# EAGLE design ventmon_t0.5c (EAGLE 9.6.2)

## Sheet 1 of 2
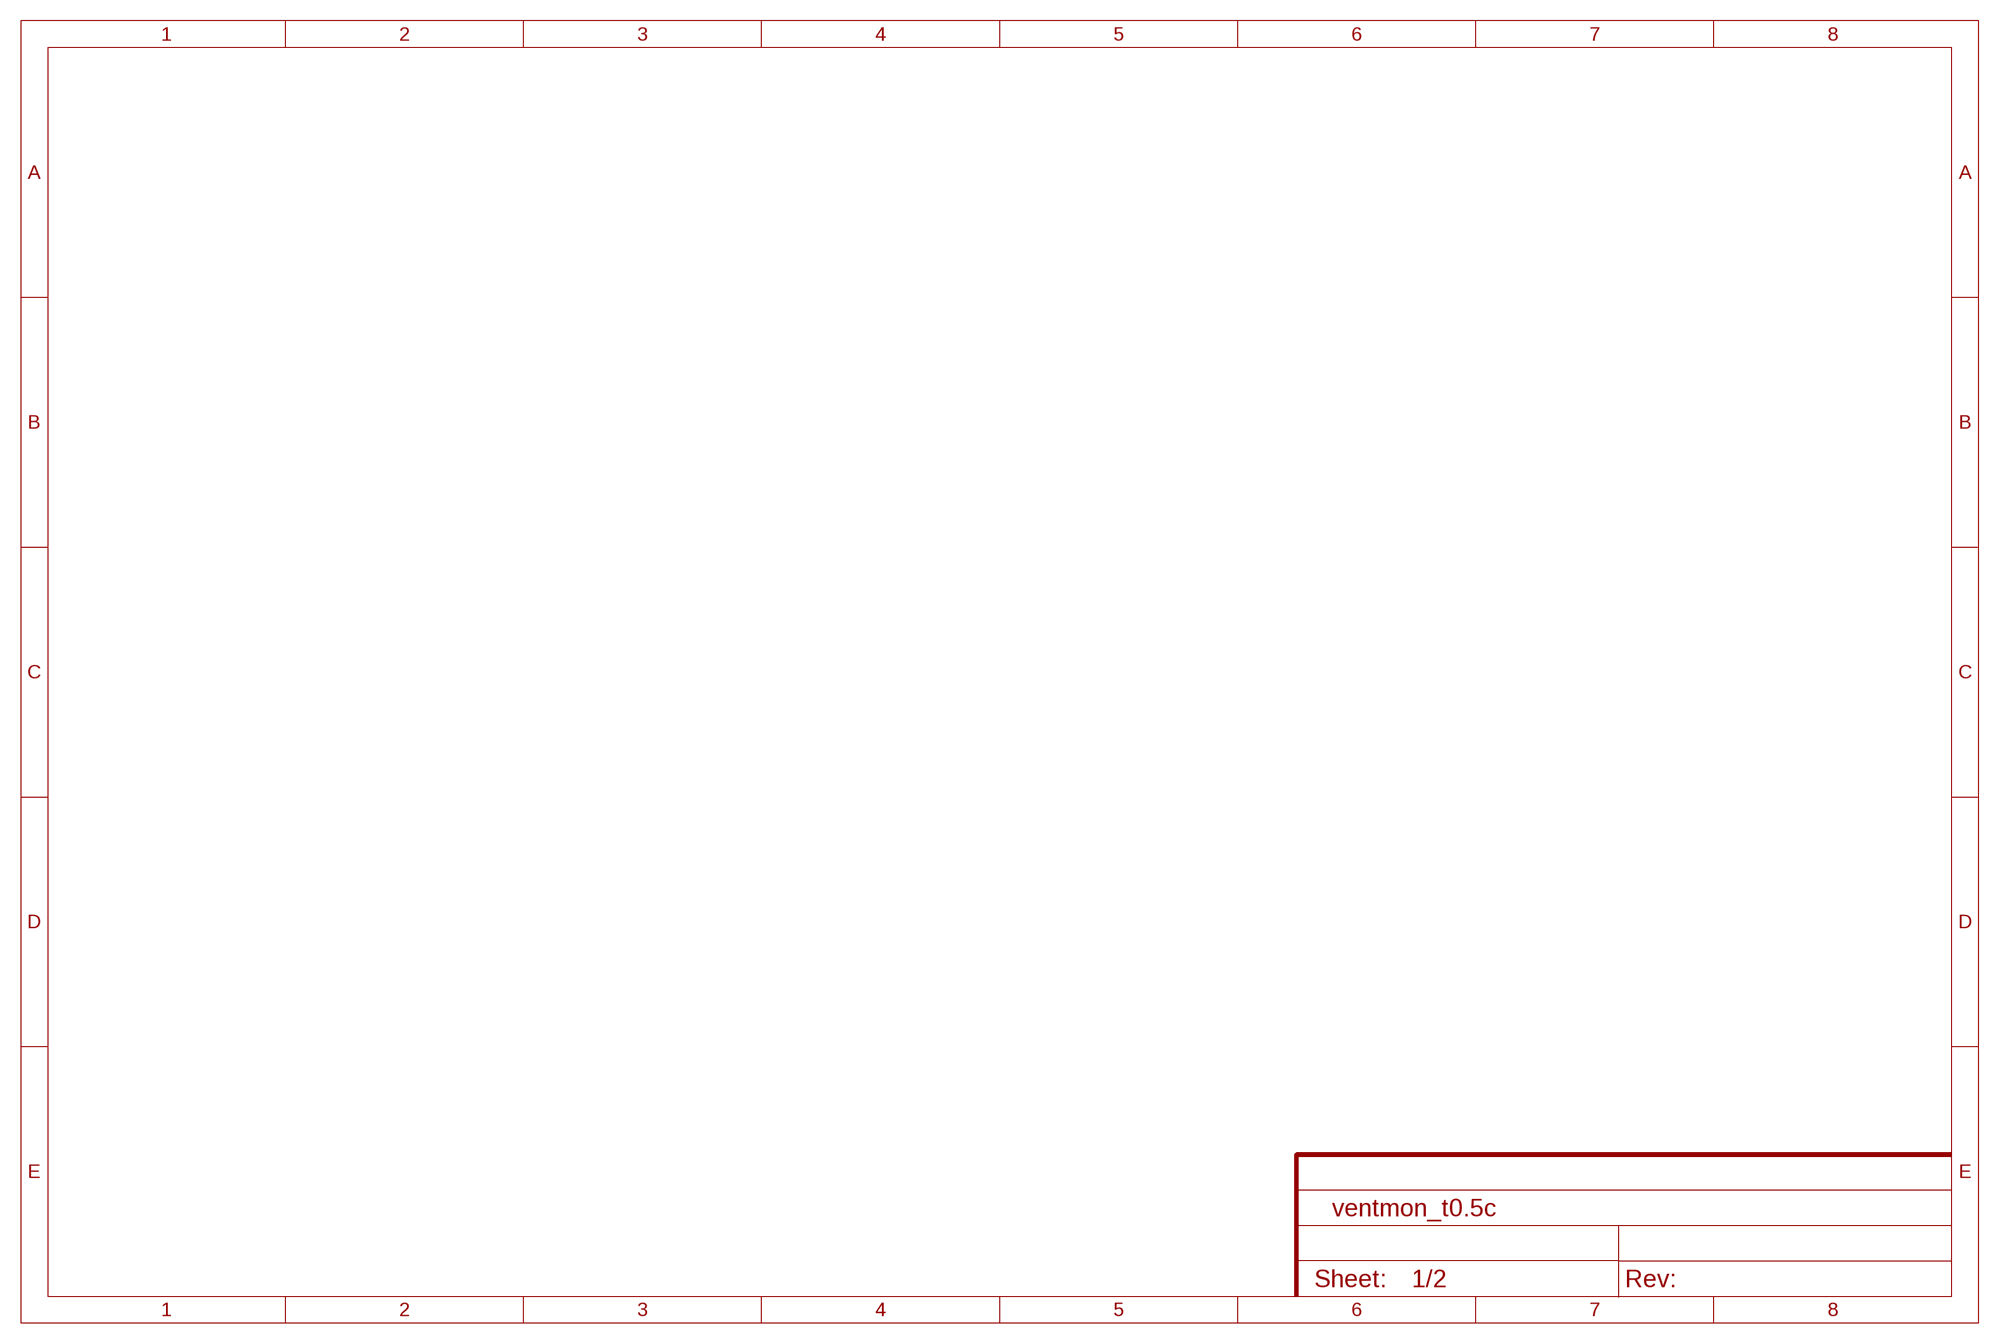
[diagram p0: schematic, sheet 1]

## Sheet 2 of 2
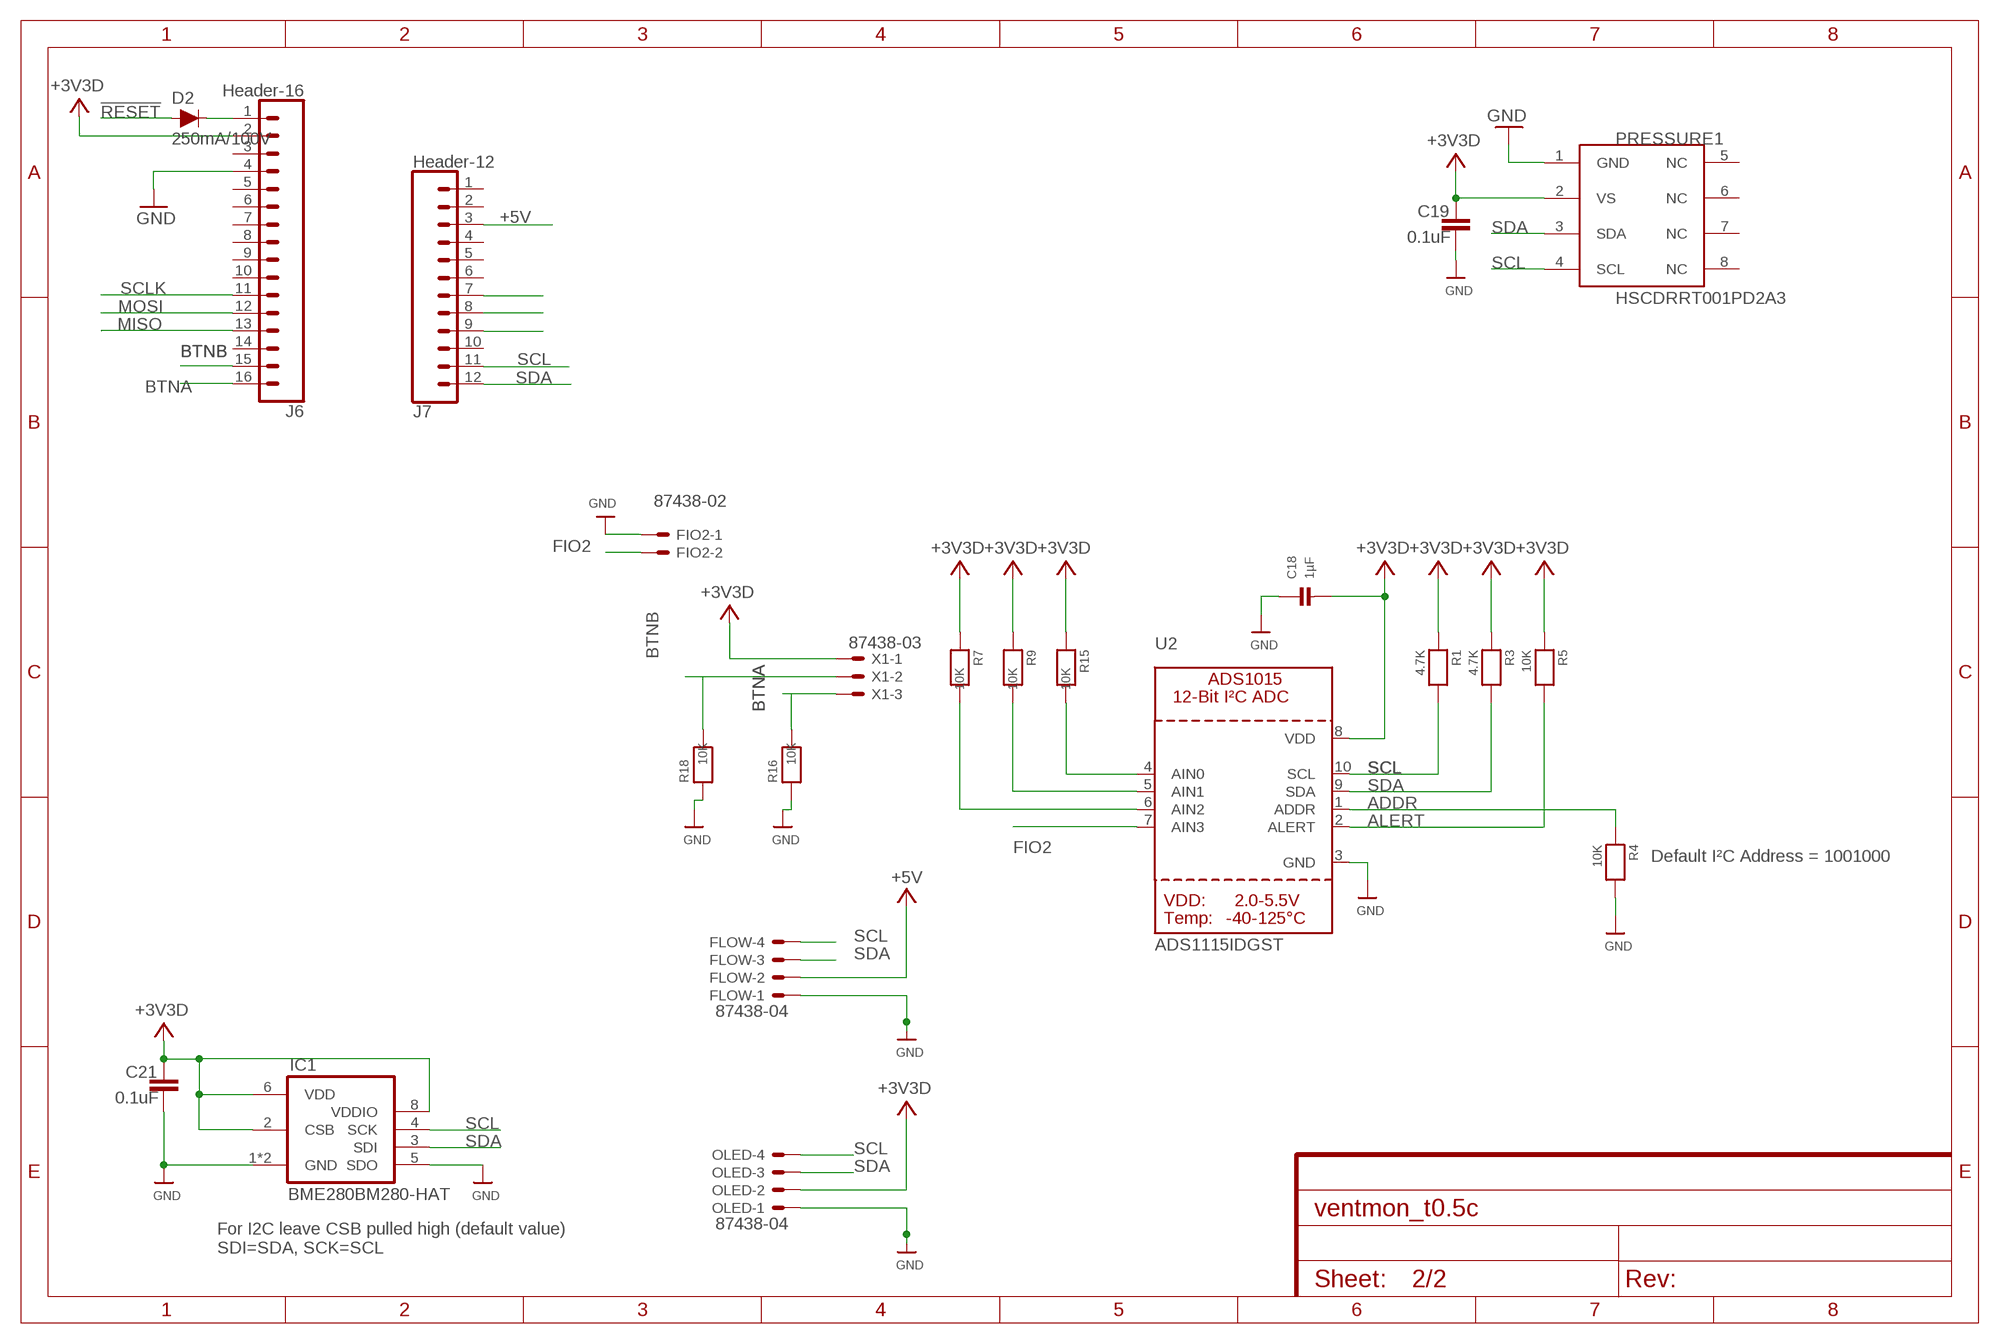
[diagram p1: schematic, sheet 2]

### Parts
C18  1µF  CAP_CERAMIC0603  [0603]
C19  0.1uF  CAP_1  [C0402_B]
C21  0.1uF  CAP_1  [C0402_B]
D2  250mA/100V  DIODE-BAS16J  [SOD-323]
FIO2  87438-02  [87438-02]
FLOW  87438-04  [87438-04]
IC1  BME280BM280-HAT  [BME280-HAT]
J6  Header-16  CONN_16  [1X16]
J7  Header-12  CONN_12  [1X12]
OLED  87438-04  [87438-04]
PRESSURE1  HSCDRRT001PD2A3  [DIP1330W46P254L1000H616Q8B]
R1  4.7K  RESISTOR0603  [0603]
R3  4.7K  RESISTOR0603  [0603]
R4  10K  RESISTOR0603  [0603]
R5  10K  RESISTOR0603  [0603]
R7  10K  RESISTOR0603  [0603]
R9  10K  RESISTOR0603  [0603]
R15  10K  RESISTOR0603  [0603]
R16  10K  RESISTOR0603  [0603]
R18  10K  RESISTOR0603  [0603]
U2  ADS1115IDGST  ADC_ADS1015  [MSOP10]
X1  87438-03  [87438-03]

### Nets
!RESET: D2.A
+3V3: C18.2 C19.2 C21.2 IC1.2(CSB) IC1.6(VDD) IC1.8(VDDIO) J6.2 OLED.2 PRESSURE1.2(VS) R1.1 R3.1 R5.1 R7.1 R9.1 R15.1 U2.8(VDD) X1.1 ; supply symbol labelled +3V3D
+5V: FLOW.2 J7.3
ADDR: R4.1 U2.1(ADDR)
ALERT: R5.2 U2.2(ALERT)
BTNA: J6.16 R16.2 X1.3
BTNB: J6.15 R18.2 X1.2
FIO2: FIO2.2 U2.7(AIN3)
GND: C18.1 C19.1 C21.1 FIO2.1 FLOW.1 IC1.1(GND) IC1.5(SDO) IC1.7(GND) J6.4 OLED.1 PRESSURE1.1(GND) R4.2 R16.1 R18.1 U2.3(GND)
MISO: J6.13
MOSI: J6.12
N$4: D2.C J6.1
N$24: J7.7
N$25: J7.8
N$26: J7.9
N$38: R7.2 U2.6(AIN2)
N$40: R9.2 U2.5(AIN1)
N$45: R15.2 U2.4(AIN0)
SCL: FLOW.4 IC1.4(SCK) J7.11 OLED.4 PRESSURE1.4(SCL) R1.2 U2.10(SCL)
SCLK: J6.11
SDA: FLOW.3 IC1.3(SDI) J7.12 OLED.3 PRESSURE1.3(SDA) R3.2 U2.9(SDA)
Unconnected: J6.3 J6.5 J6.6 J6.7 J6.8 J6.9 J6.10 J6.14 J7.1 J7.2 J7.4 J7.5 J7.6 J7.10 PRESSURE1.5(NC) PRESSURE1.6(NC) PRESSURE1.7(NC) PRESSURE1.8(NC)

### Notes on the sheet
- Default I²C Address = 1001000
- For I2C leave CSB pulled high (default value)
  SDI=SDA, SCK=SCL

## Library data of the parts
C18 = microbuilder:CAP_CERAMIC: Ceramic Capacitors 0402 - 0402 Surface Mount Capacitors 16pF 50V 5% [Digikey: 445-4899-2-ND] 18pF 50V 5% [Digikey: 490-1281-2-ND] 22pF 50V 5% [Digikey: 490-1283-2-ND] 68pF 50V 5% [Digikey: 490-1289-2-ND] 0.1uF 10V 10% [Digikey: 490-1318-2-ND] 1.0uF 6.3V 10% [Digikey: 490-1320-2-ND] 0603 - 0603 Surface Mount Capacitors 16 pF 50V 5% [Digikey: 445-5051-2-ND] 22 pF 50V [Digikey: PCC220ACVTR-ND] 33 pF 50V 5% [Digikey: 490-1415-1-ND] 56pF 50V 5% [Digikey: 490-1421-1-ND] 220pF 50V 5% [Digikey: 445-1285-1-ND] 680 pF 50V 2200 pF 50V 5% C0G [Digikey: 445-1297-1-ND] 5600 pF 100V 5% X7R [Digikey: 478-3711-1-ND] 0.1 µF 25V 10% [Digikey: PCC2277TR-ND] 0.22 µF 16V 10% X7R [Digikey: 445-1318-1-ND] 1.0 µF 25V 10% [Digikey: 445-5146-2-ND] 0603 - RF Specific 3pF 250V +/-0.1pF RF [Digikey: 712-1347-1-ND] 18 pF 250V 5% [Digikey: 478-3505-1-ND or 712-1322-1-ND] 56 pF 250V 5% C0G RF [Digikey: 490-4867-1-ND] 68 pF 250V RF [Digikey: 490-4868-1-ND] 0805 - 0805 Surface Mount Capacitors 220 pF 250V 2% RF Ceramic Capacitor [Digikey: 712-1398-1-ND] 1000 pF 50V 2% NP0 Ceramic Capacitor [Digikey: 478-3760-1-ND] 0.1 µF 25V 10% Ceramic Capacitor [Digikey: PCC1828TR-ND] 1.0 µF 16V 10% Ceramic Capacitor[Digikey: 490-1691-2-ND] 10.0 µF 10V 10% Ceramic Capacitor[Digikey: 709-1228-1-ND] 10.0 uF 16V 10% Ceramic Capacitor [Digikey: 478-5165-2-ND] 47 uF 6.3V 20% Ceramic Capacitor [Digikey: 587-1779-1-ND or 399-5506-1-ND] 1206 - 1206 Surface Mount Capacitors 47uF 10V 20% Ceramic Capacitor [Digikey: 490-5528-1-ND or 399-5508-1-ND or 445-6010-1-ND] 100uF 6.3V -20%, +80% Y5V Ceramic Capacitor (Digikey: 490-4512-1-ND, Mouser: 81-GRM31CF50J107ZE1L)
C19 C21 = Particle:CAP_1
D2 = SparkFun-DiscreteSemi:DIODE: Diode These are standard reverse protection diodes and small signal diodes. SparkFun Products: SparkFun SparkPunk Sound Kit <https://www.sparkfun.com/products/11177> SparkFun ESP8266 Thing <https://www.sparkfun.com/products/13231>; PROD_ID: DIO-09646
FIO2 = con-molex:87438-02: Wire-to-Board 1.50mm (.059") Pitch Header - Right Angle, SMT, Shrouded Source: http://www.molex.com/product/micro/87438.html; MF: MOLEX; OC_FARNELL: 1711327; OC_NEWARK: unknown
FLOW OLED = con-molex:87438-04: Wire-to-Board 1.50mm (.059") Pitch Header - Right Angle, SMT, Shrouded Source: http://www.molex.com/product/micro/87438.html; MF: MOLEX; OC_FARNELL: unknown; OC_NEWARK: unknown
IC1 = bosch-bme280:BME280: DIGITAL HUMIDITY, PRESSURE AND TEMPERATURE SENSOR * Digital interface I²C (up to 3.4 MHz) and SPI (3 and 4 wire, up to 10 MHz)* Supply voltage VDD main supply voltage range: 1.71 V to 3.6 V*VDDIO interface voltage range: 1.2 V to 3.6 V Operating range -40…+85 °C, 0…100 % rel. humidity, 300…1100 hPa The library has been designed by Richard Magdycz <https://www.facebook.com/groups/eaglecadsoftUK>
J6 = SparkFun-Connectors:CONN_16: Multi connection point. Often used as Generic Header-pin footprint for 0.1 inch spaced/style header connections On any of the 0.1 inch spaced packages, you can populate with these: Break Away Headers - Straight <https://www.sparkfun.com/products/116> (PRT-00116) Break Away Male Headers - Right Angle <https://www.sparkfun.com/products/553> (PRT-00553) Female Headers <https://www.sparkfun.com/products/115> (PRT-00115) Break Away Headers - Machine Pin <https://www.sparkfun.com/products/117> (PRT-00117) Break Away Female Headers - Swiss Machine Pin <https://www.sparkfun.com/products/743> (PRT-00743) For SCREWTERMINALS and SPRING TERMINALS visit here: Screw Terimnals on SparkFun.com <https://www.sparkfun.com/search/results?term=Screw+Terminals> (5mm/3.5mm/2.54mm spacing) This device is also useful as a general connection point to wire up your design to another part of your project. Our various solder wires solder well into these plated through hole pads. Hook-Up Wire - Assortment (Stranded, 22 AWG) <https://www.sparkfun.com/products/11375> (PRT-11375) Hook-Up Wire - Assortment (Solid Core, 22 AWG) <https://www.sparkfun.com/products/11367> (PRT-11367) View the entire wire category on our website here <https://www.sparkfun.com/categories/141> Special notes: Molex polarized connector foot print use with SKU : PRT-08231 with associated crimp pins and housings. 1MM SMD Version SKU: PRT-10208 NOTES ON THE VARIANTS LOCK and LOCK_LONGPADS... This footprint was designed to help hold the alignment of a through-hole component (i.e. 6-pin header) while soldering it into place. You may notice that each hole has been shifted either up or down by 0.005 of an inch from it's more standard position (which is a perfectly straight line). This slight alteration caused the pins (the squares in the middle) to touch the edges of the holes. Because they are alternating, it causes a "brace" to hold the component in place. 0.005 has proven to be the perfect amount of "off-center" position when using our standard breakaway headers. Although looks a little odd when you look at the bare footprint, once you have a header in there, the alteration is very hard to notice. Also,if you push a header all the way into place, it is covered up entirely on the bottom side.
J7 = SparkFun-Connectors:CONN_12: Multi connection point. Often used as Generic Header-pin footprint for 0.1 inch spaced/style header connections On any of the 0.1 inch spaced packages, you can populate with these: Break Away Headers - Straight <https://www.sparkfun.com/products/116> (PRT-00116) Break Away Male Headers - Right Angle <https://www.sparkfun.com/products/553> (PRT-00553) Female Headers <https://www.sparkfun.com/products/115> (PRT-00115) Break Away Headers - Machine Pin <https://www.sparkfun.com/products/117> (PRT-00117) Break Away Female Headers - Swiss Machine Pin <https://www.sparkfun.com/products/743> (PRT-00743) For SCREWTERMINALS and SPRING TERMINALS visit here: Screw Terimnals on SparkFun.com <https://www.sparkfun.com/search/results?term=Screw+Terminals> (5mm/3.5mm/2.54mm spacing) This device is also useful as a general connection point to wire up your design to another part of your project. Our various solder wires solder well into these plated through hole pads. Hook-Up Wire - Assortment (Stranded, 22 AWG) <https://www.sparkfun.com/products/11375> (PRT-11375) Hook-Up Wire - Assortment (Solid Core, 22 AWG) <https://www.sparkfun.com/products/11367> (PRT-11367) View the entire wire category on our website here <https://www.sparkfun.com/categories/141> Special notes: Molex polarized connector foot print use with SKU : PRT-08231 with associated crimp pins and housings. 1MM SMD Version SKU: PRT-10208 NOTES ON THE VARIANTS LOCK and LOCK_LONGPADS... This footprint was designed to help hold the alignment of a through-hole component (i.e. 6-pin header) while soldering it into place. You may notice that each hole has been shifted either up or down by 0.005 of an inch from it's more standard position (which is a perfectly straight line). This slight alteration caused the pins (the squares in the middle) to touch the edges of the holes. Because they are alternating, it causes a "brace" to hold the component in place. 0.005 has proven to be the perfect amount of "off-center" position when using our standard breakaway headers. Although looks a little odd when you look at the bare footprint, once you have a header in there, the alteration is very hard to notice. Also,if you push a header all the way into place, it is covered up entirely on the bottom side.
PRESSURE1 = HSCDRRT001PD2A3:HSCDRRT001PD2A3: Honeywell Differential Pressure Sensor Pressure Sensor ±1PSI (±6.89kPa) Differential Male - 0.08" (1.93mm) Tube, Dual 12 b 8-DIP (0.524", 13.30mm), Dual Ports, Same Side, I2C https://www.digikey.com/product-detail/en/honeywell-sensing-and-productivity-solutions/HSCDRRT001PD2A3/480-3335-ND/2601662
R1 R3-R5 R7 R9 R15 R16 R18 = microbuilder:RESISTOR: Resistors 0402 - 0402 Surface Mount Package 22 Ohm 1% 1/16W [Digikey: 311-22.0LRTR-ND] 33 Ohm 5% 1/16W 1.0K 5% 1/16W 1.5K 5% 1/16W 2.0K 1% 1/16W 10.0K 1% 1/16W [Digikey: 311-10.0KLRTR-ND] 10.0K 5% 1/16W [Digikey: RMCF0402JT10K0TR-ND] 12.1K 1% 1/16W [Digikey: 311-22.0LRTR-ND] 100.0K 5% 1/16W 0603 - 0603 Surface Mount Package 0 Ohm 1/10 Watt 1% Resistor 15 Ohm 1/10 Watt 1% Resistor 33 Ohm 1/10 Watt 1% Resistor 49.9 Ohm 1/10 Watt 1% Resistor 100 Ohm 1/10 Watt 1% Resistor 150 Ohm 1/10 Watt 1% Resistor 240 Ohm 1/10 Watt 1% Resistor 390 Ohm 1/10 Watt 1% Resistor 560 Ohm 1/10 Watt 1% Resistor 680 Ohm 1/10 Watt 1% Resistor 750 Ohm 1/10 Watt 1% Resistor 1.0K Ohm 1/10 Watt 1% Resistor 1.5K Ohm 1/10 Watt 1% Resistor 2.0K Ohm 1/10 Watt 1% Resistor 2.2K Ohm 1/10 Watt 1% Resistor 3.3K Ohm 1/10 Watt 1% Resistor 4.7K Ohm 1/10 Watt 1% Resistor 10.0K Ohm 1/10 Watt 1% Resistor 12.0K Ohm 1/10 Watt 1% Resistor 12.1K Ohm 1/10 Watt 1% Resistor 20.0K Ohm 1/10 Watt 1% Resistor 33.0K Ohm 1/10 Watt 1% Resistor 100.0K Ohm 1/10 Watt 1% Resistor 0805 - 0805 Surface Mount Package 0 Ohm 1/8 Watt 1% Resistor 33 Ohm 1/8 Watt 1% Resistor 100 Ohm 1/8 Watt 1% Resistor 150 Ohm 1/8 Watt 1% Resistor 200 Ohm 1/8 Watt 1% Resistor 240 Ohm 1/8 Watt 1% Resistor 330 Ohm 1/8 Watt 1% Resistor 390 Ohm 1/8 Watt 1% Resistor 470 Ohm 1/8 Watt 1% Resistor 1.0K Ohm 1/8 Watt 1% Resistor 1.5K Ohm 1/8 Watt 1% Resistor 2.0K Ohm 1/8 Watt 1% Resistor 4.7K Ohm 1/8 Watt 1% Resistor 5.1K Ohm 1/8 Watt 1% Resistor 5.6K Ohm 1/8 Watt 1% Resistor 10.0K Ohm 1/8 Watt 1% Resistor 22.0K Ohm 1/8 Watt 1% Resistor 33.0K Ohm 1/8 Watt 1% Resistor 100K Ohm 1/8 Watt 1% Resistor 1206 - 1206 Surface Mount Package 2012 - 2010 Surface Mount Package 0.11 Ohm 1/2 Watt 1% Resistor - Digikey: RHM.11UCT-ND
U2 = microbuilder:ADC_ADS1015: ADS1015 - 12-bit 4-Channel I2C ADC with Internal PGA VDD: 2.0-5.5V Sampling Rate: 3.3ksps Gain Settings: 2/3, 1, 2, 4, 8, 16 I2C Address: ADDR low = 1001000x, ADDR high = 1001001x Internal Comparator The ADS1015 includes an internal comparator that can be set to output a high-level on ALERT when the conversion results exceeeds a pre-defined upper level, and will deassert itself when the level falls below a pre-defined lower threshold level. It can also be set to windowed mode where the ALERT pin will be asserted if the data exceeds the upper threshold or falls below the lower threshold.
X1 = con-molex:87438-03: Wire-to-Board 1.50mm (.059") Pitch Header - Right Angle, SMT, Shrouded Source: http://www.molex.com/product/micro/87438.html; MF: MOLEX; OC_FARNELL: 1711328; OC_NEWARK: unknown

## Board
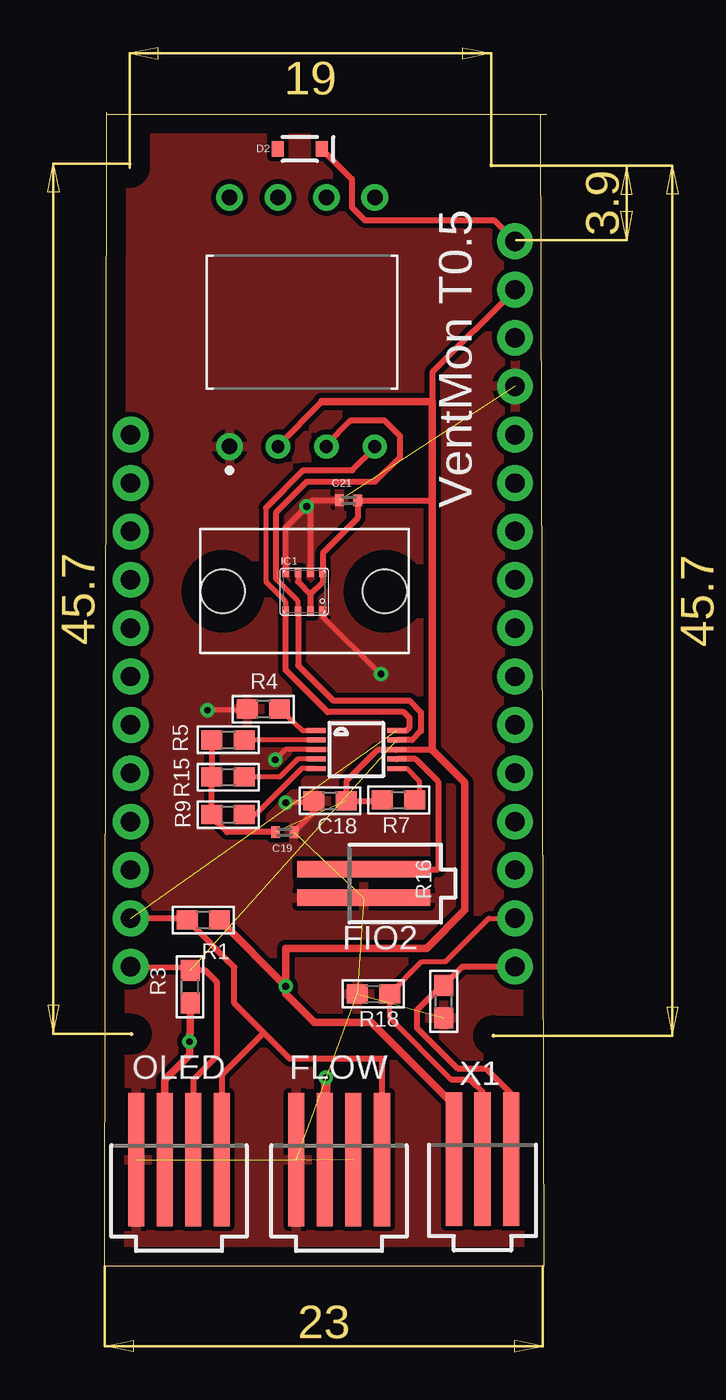
[diagram p2: board, top side]
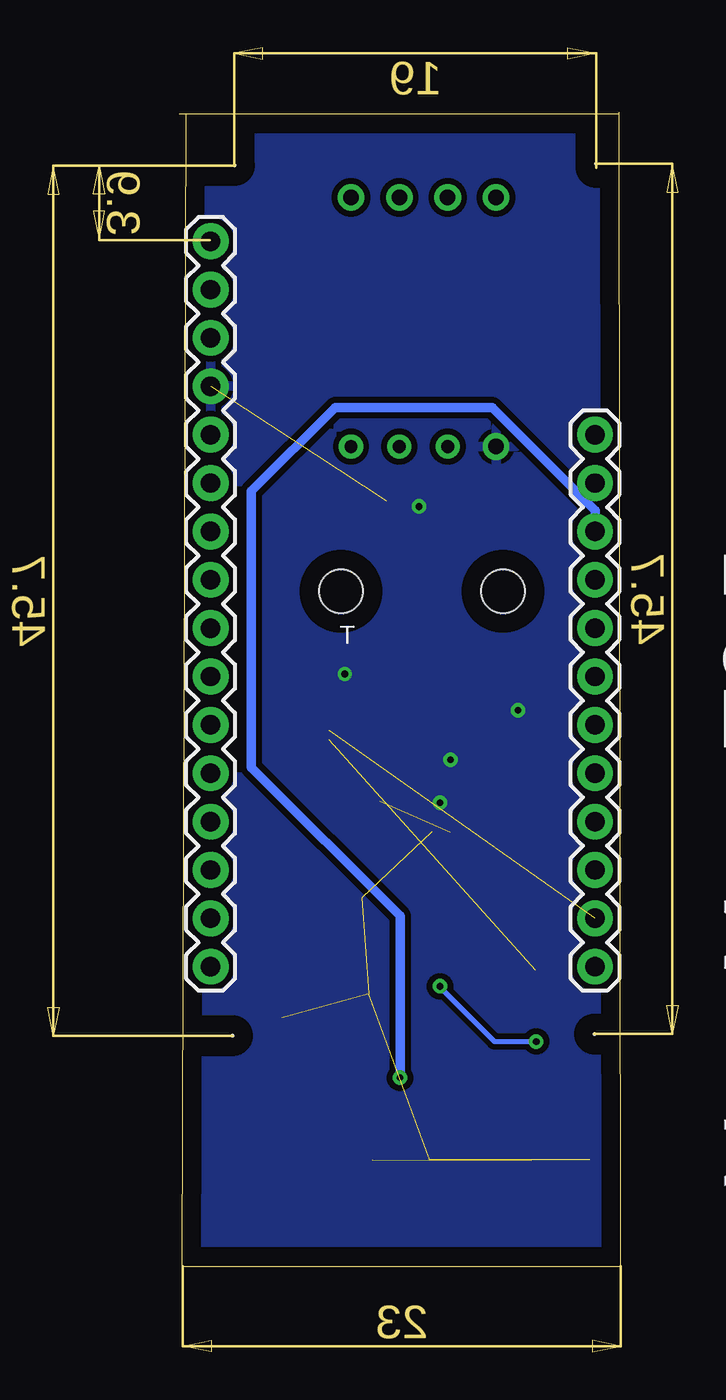
[diagram p3: board, bottom side, seen from below]

Size 23.2 x 60.6 mm. Coordinates in mm from the lower left corner, seen from the top.
Outline: 0.1,60.6 0,0 23,0
Outline: 0.1,60.5 23.2,60.5
Outline: 22.85,60.5 23.05,0
Copper layers (1*16): Top 0.035mm / dielectric 1.5mm / Bottom 0.035mm
Design rules "default *": minimum track width 6mil, minimum drill 10mil, track to track 6mil, track to pad 6mil, pad to pad 6mil, via to via 6mil, smd to smd 6mil, copper to edge 40mil, drill to drill 6mil, minimum pad ring 10mil, minimum via ring 8mil, stop-mask expansion 4mil, vias tented up to drill 0.35mm, thermal gap 10mil
Holes 0.09 mm at 20.3,57.8 1.3,57.9 1.4,12.2 20.4,12.1

### Footprints (pad centres in the part's own frame; a part is rotated, then mirrored left to right if it is on the bottom)
0603 = smd 1.1 x 1: 1 -0.85,0; 2 0.85,0
C0402_B = smd 0.457 x 0.61: 1 -0.483,0; 2 0.483,0
SOD-323 = smd 0.63 x 0.83: A 1.15,0; C -1.15,0
87438-02 = smd 7 x 0.85: 1 0,0.75; 2 0,-0.75
87438-04 = smd 7 x 0.85: 1 0,2.25; 2 0,0.75; 3 0,-0.75; 4 0,-2.25
BME280-HAT = smd 0.35 x 0.5: 1 2.245,-2.295; 2 1.595,-2.295; 3 0.945,-2.295; 4 0.295,-2.295; 5 0.295,-0.245; 6 0.945,-0.245; 7 1.595,-0.245; 8 2.245,-0.245 | hole 2.3: 5.5,-1.25; -3,-1.25
1X16 = drill 1.016 pad 1.88: 1 0,0; 2 2.54,0; 3 5.08,0; 4 7.62,0; 5 10.16,0; 6 12.7,0; 7 15.24,0; 8 17.78,0; 9 20.32,0; 10 22.86,0; 11 25.4,0; 12 27.94,0; 13 30.48,0; 14 33.02,0; 15 35.56,0; 16 38.1,0
1X12 = drill 1.016 pad 1.88: 1 0,0; 2 2.54,0; 3 5.08,0; 4 7.62,0; 5 10.16,0; 6 12.7,0; 7 15.24,0; 8 17.78,0; 9 20.32,0; 10 22.86,0; 11 25.4,0; 12 27.94,0
DIP1330W46P254L1000H616Q8B = drill 0.813 pad 1.397: 1 -6.54,3.81; 5 6.54,-3.81; 6 6.54,-1.27; 7 6.54,1.27; 8 6.54,3.81 | drill 0.675 pad 1.275: 2 -6.54,1.27; 3 -6.54,-1.27; 4 -6.54,-3.81
MSOP10 = smd 0.25 x 1: 1 -1,-2.113; 2 -0.5,-2.113; 3 0,-2.113; 4 0.5,-2.113; 5 1,-2.113; 6 1,2.113; 7 0.5,2.113; 8 0,2.113; 9 -0.5,2.113; 10 -1,2.113
87438-03 = smd 7 x 0.85: 1 0,1.5; 2 0,0; 3 0,-1.5

### Placement (x,y rotation side)
C18  11.82,24.44 0 top
C19  9.45,22.8 180 top
C21  12.8,40.22 0 top
D2  10.23,58.68 180 top
FIO2  13.6,20.1 180 top
FLOW  12.3,5.6 90 top
IC1  9.2,36.7 0 top
J6  21.54,53.83 270 bottom
J7  1.36,43.67 270 bottom
OLED  3.9,5.6 90 top
PRESSURE1  10.37,49.59 90 top
R1  5.17,18.18 180 top
R3  4.48,14.68 90 top
R4  8.32,29.26 180 top
R5  6.47,27.65 0 top
R7  15.43,24.49 0 top
R9  6.47,23.72 0 top
R15  6.47,25.68 0 top
R16  17.8,13.9 90 top
R18  14.1,14.3 0 top
U2  13.21,27.13 270 top
X1  19.83,5.63 90 top

### Tracks (layer width: path | path; a pad name or v marks a point on that pad's centre or on a via)
+3V3  (via drill 0.35)  (1 unrouted)
  Top 0.2: 10.8,35.3 10.79,35.3
  Top 0.305: IC1.6 10.14,35.95 10.8,35.3 11.45,35.95 IC1.8 11.45,37.45 13.28,39.28 C21.2 | 10.79,35.3 IC1.2 10.79,34.45 | R7.1 14.54,24.45 C18.2 12.72,25.52 14.3,27.1 15.29,27.1 U2.8 17.2,27.13 | 5.53,23.77 5.6,23.74 R9.1 | 18.33,8.93 X1.1 18.33,8.47 | 13.28,40.32 C21.2 | C21.2 13.3,40.2 17.2,40.2 | 11.4,45.4 9.1,43.09 PRESSURE1.2 | R1.1 5.83,18.48 | R9.1 5.7,23.65 | R9.1 R15.1 R5.1 | R9.1 5.62,23.6 6.42,22.8 C19.2 | J6.2 17.2,46.95 17.2,45.4
  Top 0.406: 5.32,23.72 R9.1 | 18.33,8.47 14,12.8 11,12.8 9.5,14.3 v9.5,14.7 | OLED.2 3.15,9.8 4.45,11.1 v4.45,11.8 4.45,12.2 4.48,12.23 R3.1 | R1.1 v9.5,14.7 | v9.5,14.7 9.5,16.7 16.9,16.7 18.9,18.7 18.9,25.4 17.2,27.1 17.2,27.13 17.2,40.2 17.2,45.4 11.4,45.4
  Bottom 0.254: v9.5,14.7 9.5,14.65 6.65,11.8 v4.45,11.8
+5V  (via drill 0.35)
  Top 0.508: v11.6,9.9 11.6,5.65 FLOW.2
  Bottom 0.508: J7.3 1.36,39.69 6.76,45.09 15.01,45.09 19.4,40.7 19.4,26.2 11.6,18.4 v11.6,9.9 11.6,9.8
ADDR
  Top 0.254: R4.1 10.4,28.13 U2.1
ALERT
  Top 0.254: U2.2 7.41,27.63 R5.2
BTNA
  Top 0.305: X1.3 21.33,9.06 20,10.39 18.51,10.39 16.4,12.5 16.4,13.45 17.7,14.75 R16.2 18.78,15.73 J6.16
BTNB
  Top 0.254: 18.2,9.8 14.95,13.05 R18.2 16.65,16 17.9,16 20.17,18.27 J6.15
  Top 0.305: X1.2 19.83,9.17 19.2,9.8 18.2,9.8
FIO2
  Top 0.305: FIO2.2 17.5,20.85 17.5,25.45 16.32,26.63 U2.7
GND  (via drill 0.35)  (6 unrouted)
  Top 0.254: 10.9,40.22 10.9,40.2 v10.6,39.9 10.79,40.09 | IC1.1 11.45,34.1 14.45,31.1 v14.5,31.1 | R4.2 7.32,29.2 v5.4,29.2 | C18.1 10.97,24.35 v9.5,24.35 | U2.3 9.48,27.13 v8.95,26.6
  Top 0.305: C21.1 10.9,40.22 | 10.79,40.09 IC1.7 | IC1.5 9.49,38.8 v10.6,39.9 | C18.1 11.03,24.5 11.03,23.9 C19.1
  pour Top (isolate 0.254): -1.3,61.1 -1.3,-4.72 25.3,-4.72 25.3,61.1
  pour Bottom (isolate 0.305): -0.7,61.7 -0.7,-3.2 1.8,-5.7 23.1,-5.7 25.2,-3.6 25.2,61.7
MISO
  Top 0.203: 21.44,23.45 J6.13
N$4
  Top 0.305: D2.C 12.97,57.09 12.97,55.61 13.66,54.93 20.44,54.93 J6.1
N$38
  Top 0.254: U2.6 15.87,26.13 16.52,25.48 16.52,24.69 R7.2
N$40
  Top 0.254: U2.5 10.34,26.13 7.92,23.72 R9.2
N$45
  Top 0.254: R15.2 9.18,25.68 10.13,26.63 U2.4
SCL  (1 unrouted)
  Top 0.254: IC1.4 9.49,34.91 8.47,35.93 8.47,39.83
  Top 0.305: FLOW.4 14.55,10.9 9.7,10.9 8.35,12.25 | U2.10 15.83,28.13 16,28.3 16,28.8 15.7,29.1 11.7,29.1 9.49,31.3 IC1.4 | 8.47,39.83 10.43,41.8 13,41.8 14.18,42.98 PRESSURE1.4 | J7.11 4.23,18.27 R1.2 6.8,15.7 6.8,13.8 8.35,12.25 | 8.35,12.25 6.15,10.05 OLED.4
  Bottom 0.152: J7.11
SDA  (2 unrouted)
  Top 0.2: 10.12,34.43 IC1.3 | 4.6,4.3 4.6,4.5 4.65,4.55 4.65,5.1
  Top 0.254: 10.12,34.43 10.12,34.96 9.02,36.06
  Top 0.305: OLED.3 4.65,5.1 | 13.1,5.55 FLOW.3 | 9.02,36.07 9.02,36.06 9.02,36.08 9.02,39.62 10.6,41.2 14.2,41.2 15.5,42.5 15.5,43.6 14.7,44.4 12.9,44.4 11.63,43.13 PRESSURE1.3 | IC1.3 10.14,31.55 12,29.7 16,29.7 16.6,29.1 16.6,28.1 16.13,27.63 U2.9 | J7.12 4.29,15.68 4.3,15.69 R3.2 5.27,15.53 5.9,14.9 5.9,11.05 4.65,9.8 OLED.3 | OLED.3 4.7,5.55

### Text on the board
tPlace: VentMon T0.5
bPlace: VentMon T0.5 | Public Invention